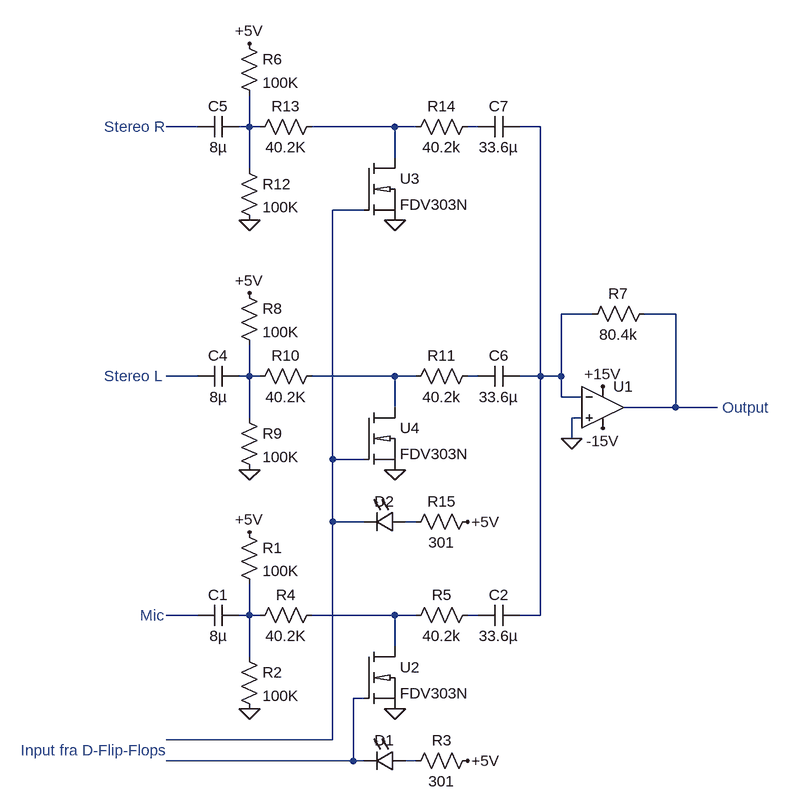
[diagram p0: schematic indgangsvaelger-diagram.asc]
indgangsvaelger-diagram.asc, the LTspice schematic file:
Version 4
SHEET 1 900 868
WIRE -416 -448 -464 -448
WIRE -336 -448 -336 -496
WIRE -336 -448 -352 -448
WIRE -320 -448 -336 -448
WIRE -112 -448 -240 -448
WIRE -80 -448 -112 -448
WIRE 16 -448 0 -448
WIRE 112 -448 80 -448
WIRE -112 -400 -112 -448
WIRE -336 -384 -336 -448
WIRE -160 -320 -208 -320
WIRE 192 -160 144 -160
WIRE 320 -160 272 -160
WIRE -416 -64 -464 -64
WIRE -336 -64 -336 -112
WIRE -336 -64 -352 -64
WIRE -320 -64 -336 -64
WIRE -112 -64 -240 -64
WIRE -80 -64 -112 -64
WIRE 16 -64 0 -64
WIRE 112 -64 112 -448
WIRE 112 -64 80 -64
WIRE 144 -64 144 -160
WIRE 144 -64 112 -64
WIRE 144 -32 144 -64
WIRE 176 -32 144 -32
WIRE -112 -16 -112 -64
WIRE 320 -16 320 -160
WIRE 320 -16 240 -16
WIRE 384 -16 320 -16
WIRE -336 0 -336 -64
WIRE 176 0 160 0
WIRE 160 32 160 0
WIRE -208 64 -208 -320
WIRE -160 64 -208 64
WIRE -208 160 -208 64
WIRE -160 160 -208 160
WIRE -80 160 -96 160
WIRE -416 304 -464 304
WIRE -336 304 -336 256
WIRE -336 304 -352 304
WIRE -320 304 -336 304
WIRE -112 304 -240 304
WIRE -80 304 -112 304
WIRE 16 304 0 304
WIRE 112 304 112 -64
WIRE 112 304 80 304
WIRE -112 352 -112 304
WIRE -336 368 -336 304
WIRE -160 432 -176 432
WIRE -208 496 -208 160
WIRE -208 496 -464 496
WIRE -176 528 -176 432
WIRE -176 528 -464 528
WIRE -160 528 -176 528
WIRE -80 528 -96 528
FLAG -336 80 0
FLAG -112 80 0
FLAG -336 448 0
FLAG -112 448 0
FLAG -336 -304 0
FLAG -112 -304 0
FLAG 160 32 0
FLAG 208 -48 +15V
FLAG 208 16 -15V
FLAG -336 -576 +5V
FLAG -336 -192 +5V
FLAG -336 176 +5V
FLAG 0 528 +5V
FLAG 0 160 +5V
SYMBOL cap 16 320 R270
WINDOW 0 32 32 VTop 0
WINDOW 3 0 32 VBottom 0
SYMATTR InstName C2
SYMATTR Value 33.6µ
SYMBOL res 288 -176 R90
WINDOW 0 0 56 VBottom 0
WINDOW 3 32 56 VTop 0
SYMATTR InstName R7
SYMATTR Value 80.4k
SYMBOL Opamps\\UniversalOpamp2 208 -16 R0
SYMATTR InstName U1
SYMBOL cap -352 -80 R90
WINDOW 0 0 32 VBottom 0
WINDOW 3 32 32 VTop 0
SYMATTR InstName C4
SYMATTR Value 8µ
SYMBOL res -352 -208 R0
SYMATTR InstName R8
SYMATTR Value 100K
SYMBOL res -352 -16 R0
SYMATTR InstName R9
SYMATTR Value 100K
SYMBOL res -224 -80 R90
WINDOW 0 0 56 VBottom 0
WINDOW 3 32 56 VTop 0
SYMATTR InstName R10
SYMATTR Value 40.2K
SYMBOL res 16 -80 R90
WINDOW 0 0 56 VBottom 0
WINDOW 3 32 56 VTop 0
SYMATTR InstName R11
SYMATTR Value 40.2k
SYMBOL myLib\\FDV303 -160 -16 R0
SYMATTR InstName U4
SYMBOL cap -352 288 R90
WINDOW 0 0 32 VBottom 0
WINDOW 3 32 32 VTop 0
SYMATTR InstName C1
SYMATTR Value 8µ
SYMBOL res -352 160 R0
SYMATTR InstName R1
SYMATTR Value 100K
SYMBOL res -352 352 R0
SYMATTR InstName R2
SYMATTR Value 100K
SYMBOL res -224 288 R90
WINDOW 0 0 56 VBottom 0
WINDOW 3 32 56 VTop 0
SYMATTR InstName R4
SYMATTR Value 40.2K
SYMBOL res 16 288 R90
WINDOW 0 0 56 VBottom 0
WINDOW 3 32 56 VTop 0
SYMATTR InstName R5
SYMATTR Value 40.2k
SYMBOL myLib\\FDV303 -160 352 R0
SYMATTR InstName U2
SYMBOL cap 16 -48 R270
WINDOW 0 32 32 VTop 0
WINDOW 3 0 32 VBottom 0
SYMATTR InstName C6
SYMATTR Value 33.6µ
SYMBOL cap -352 -464 R90
WINDOW 0 0 32 VBottom 0
WINDOW 3 32 32 VTop 0
SYMATTR InstName C5
SYMATTR Value 8µ
SYMBOL res -352 -592 R0
SYMATTR InstName R6
SYMATTR Value 100K
SYMBOL res -352 -400 R0
SYMATTR InstName R12
SYMATTR Value 100K
SYMBOL res -224 -464 R90
WINDOW 0 0 56 VBottom 0
WINDOW 3 32 56 VTop 0
SYMATTR InstName R13
SYMATTR Value 40.2K
SYMBOL res 16 -464 R90
WINDOW 0 0 56 VBottom 0
WINDOW 3 32 56 VTop 0
SYMATTR InstName R14
SYMATTR Value 40.2k
SYMBOL myLib\\FDV303 -160 -400 R0
SYMATTR InstName U3
SYMBOL cap 16 -432 R270
WINDOW 0 32 32 VTop 0
WINDOW 3 0 32 VBottom 0
SYMATTR InstName C7
SYMATTR Value 33.6µ
SYMBOL LED -96 512 R90
WINDOW 0 0 32 VBottom 0
WINDOW 3 72 32 VTop 0
SYMATTR InstName D1
SYMATTR Value ""
SYMBOL LED -96 144 R90
WINDOW 0 0 32 VBottom 0
WINDOW 3 72 32 VTop 0
SYMATTR InstName D2
SYMATTR Value ""
SYMBOL res 16 512 R90
WINDOW 0 0 56 VBottom 0
WINDOW 3 32 56 VTop 0
SYMATTR InstName R3
SYMATTR Value 301
SYMBOL res 16 144 R90
WINDOW 0 0 56 VBottom 0
WINDOW 3 32 56 VTop 0
SYMATTR InstName R15
SYMATTR Value 301
TEXT -560 -448 Left 0 ;Stereo R
TEXT -560 -64 Left 0 ;Stereo L
TEXT -504 304 Left 0 ;Mic
TEXT 392 -16 Left 0 ;Output
TEXT -688 512 Left 0 ;Input fra D-Flip-Flops

The netlist it stands for:
* indgangsvaelger-diagram.asc
C2 N016 N005 33.6µ
R7 N007 N005 80.4k
XU1 0 N005 +15V -15V N007 level.2 Avol=1Meg GBW=10Meg Slew=10Meg ilimit=25m rail=0 Vos=0 phimargin=45 en=0 enk=0 in=0 ink=0 Rin=500Meg  ; pins IN+ IN- V+ V- OUT
C4 N009 N008 8µ
R8 +5V N009 100K
R9 N009 0 100K
R10 N010 N009 40.2K
R11 N011 N010 40.2k
XU4 N010 N006 0 FDV303N  ; pins D G S
C1 N014 N013 8µ
R1 +5V N014 100K
R2 N014 0 100K
R4 N015 N014 40.2K
R5 N016 N015 40.2k
XU2 N015 N017 0 FDV303N  ; pins D G S
C6 N011 N005 33.6µ
C5 N002 N001 8µ
R6 +5V N002 100K
R12 N002 0 100K
R13 N003 N002 40.2K
R14 N004 N003 40.2k
XU3 N003 N006 0 FDV303N  ; pins D G S
C7 N004 N005 33.6µ
D1 N018 N017
D2 N012 N006
R3 +5V N018 301
R15 +5V N012 301
.model D D
.lib standard.dio
* Stereo R
* Stereo L
* Mic
* Output
* Input fra D-Flip-Flops
.lib UniversalOpamps2.sub
.lib myLib\FDV303N.lib
.backanno
.end